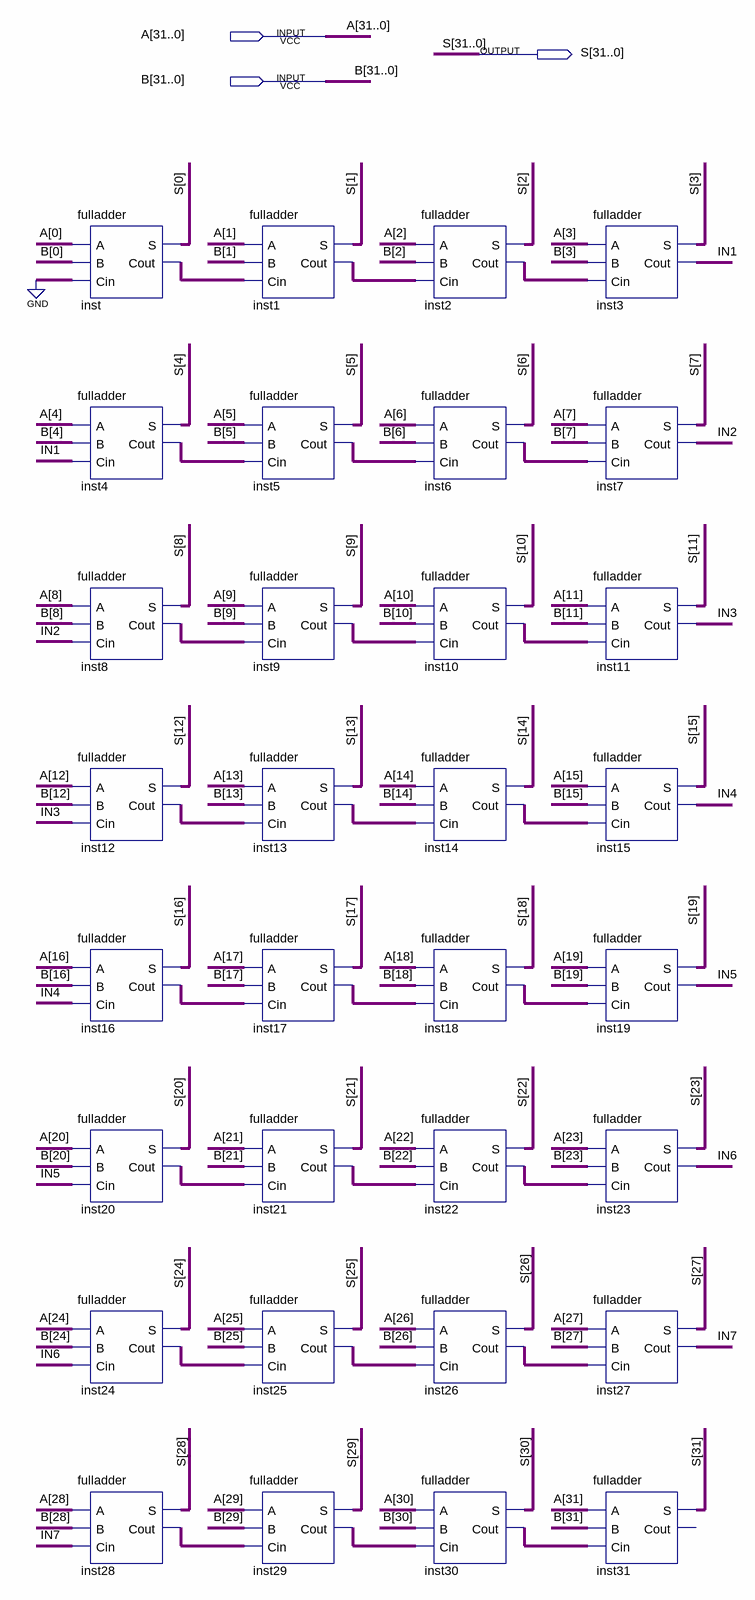
[diagram p0: schematic sheet]
// Quartus schematic add_32bit.bdf as structural Verilog: 32 symbols, 3 pins
module add_32bit (
  input  [31:0] A,
  input  [31:0] B,
  output [31:0] S
);

  wire IN1, IN2, IN3, IN4, IN5, IN6, IN7, inst1_cout, inst2_cout, inst4_cout, inst5_cout, inst6_cout,
       inst8_cout, inst9_cout, inst10_cout, inst12_cout, inst13_cout, inst14_cout, inst16_cout, inst17_cout,
       inst18_cout, inst20_cout, inst21_cout, inst22_cout, inst24_cout, inst25_cout, inst26_cout,
       inst28_cout, inst29_cout, inst30_cout, inst_cout;

  fulladder inst (.A(A[0]), .B(B[0]), .Cin(1'b0), .S(S[0]), .Cout(inst_cout));
  fulladder inst4 (.A(A[4]), .B(B[4]), .Cin(IN1), .S(S[4]), .Cout(inst4_cout));
  fulladder inst8 (.A(A[8]), .B(B[8]), .Cin(IN2), .S(S[8]), .Cout(inst8_cout));
  fulladder inst12 (.A(A[12]), .B(B[12]), .Cin(IN3), .S(S[12]), .Cout(inst12_cout));
  fulladder inst16 (.A(A[16]), .B(B[16]), .Cin(IN4), .S(S[16]), .Cout(inst16_cout));
  fulladder inst20 (.A(A[20]), .B(B[20]), .Cin(IN5), .S(S[20]), .Cout(inst20_cout));
  fulladder inst24 (.A(A[24]), .B(B[24]), .Cin(IN6), .S(S[24]), .Cout(inst24_cout));
  fulladder inst28 (.A(A[28]), .B(B[28]), .Cin(IN7), .S(S[28]), .Cout(inst28_cout));
  fulladder inst1 (.A(A[1]), .B(B[1]), .Cin(inst_cout), .S(S[1]), .Cout(inst1_cout));
  fulladder inst5 (.A(A[5]), .B(B[5]), .Cin(inst4_cout), .S(S[5]), .Cout(inst5_cout));
  fulladder inst9 (.A(A[9]), .B(B[9]), .Cin(inst8_cout), .S(S[9]), .Cout(inst9_cout));
  fulladder inst13 (.A(A[13]), .B(B[13]), .Cin(inst12_cout), .S(S[13]), .Cout(inst13_cout));
  fulladder inst17 (.A(A[17]), .B(B[17]), .Cin(inst16_cout), .S(S[17]), .Cout(inst17_cout));
  fulladder inst21 (.A(A[21]), .B(B[21]), .Cin(inst20_cout), .S(S[21]), .Cout(inst21_cout));
  fulladder inst25 (.A(A[25]), .B(B[25]), .Cin(inst24_cout), .S(S[25]), .Cout(inst25_cout));
  fulladder inst29 (.A(A[29]), .B(B[29]), .Cin(inst28_cout), .S(S[29]), .Cout(inst29_cout));
  fulladder inst2 (.A(A[2]), .B(B[2]), .Cin(inst1_cout), .S(S[2]), .Cout(inst2_cout));
  fulladder inst6 (.A(A[6]), .B(B[6]), .Cin(inst5_cout), .S(S[6]), .Cout(inst6_cout));
  fulladder inst10 (.A(A[10]), .B(B[10]), .Cin(inst9_cout), .S(S[10]), .Cout(inst10_cout));
  fulladder inst14 (.A(A[14]), .B(B[14]), .Cin(inst13_cout), .S(S[14]), .Cout(inst14_cout));
  fulladder inst18 (.A(A[18]), .B(B[18]), .Cin(inst17_cout), .S(S[18]), .Cout(inst18_cout));
  fulladder inst22 (.A(A[22]), .B(B[22]), .Cin(inst21_cout), .S(S[22]), .Cout(inst22_cout));
  fulladder inst26 (.A(A[26]), .B(B[26]), .Cin(inst25_cout), .S(S[26]), .Cout(inst26_cout));
  fulladder inst30 (.A(A[30]), .B(B[30]), .Cin(inst29_cout), .S(S[30]), .Cout(inst30_cout));
  fulladder inst3 (.A(A[3]), .B(B[3]), .Cin(inst2_cout), .S(S[3]), .Cout(IN1));
  fulladder inst7 (.A(A[7]), .B(B[7]), .Cin(inst6_cout), .S(S[7]), .Cout(IN2));
  fulladder inst11 (.A(A[11]), .B(B[11]), .Cin(inst10_cout), .S(S[11]), .Cout(IN3));
  fulladder inst15 (.A(A[15]), .B(B[15]), .Cin(inst14_cout), .S(S[15]), .Cout(IN4));
  fulladder inst19 (.A(A[19]), .B(B[19]), .Cin(inst18_cout), .S(S[19]), .Cout(IN5));
  fulladder inst23 (.A(A[23]), .B(B[23]), .Cin(inst22_cout), .S(S[23]), .Cout(IN6));
  fulladder inst27 (.A(A[27]), .B(B[27]), .Cin(inst26_cout), .S(S[27]), .Cout(IN7));
  fulladder inst31 (.A(A[31]), .B(B[31]), .Cin(inst30_cout), .S(S[31]));  // open: Cout
endmodule
